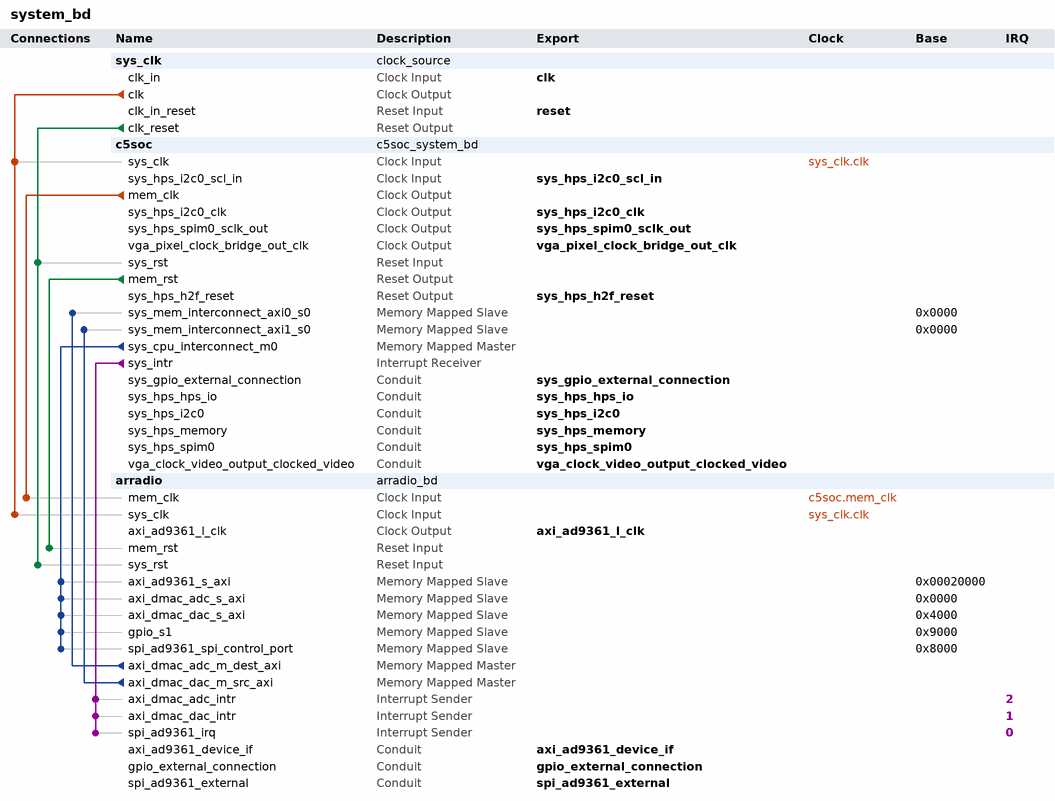
[diagram p0: system contents]
# Platform Designer (Qsys) system system_bd, Cyclone V 5CSXFC6D6F31C8ES
# Parameters at their usual value, and those the tool derives, are not listed.
package require -exact qsys 16.0
create_system system_bd
set_project_property DEVICE_FAMILY {Cyclone V}
set_project_property DEVICE 5CSXFC6D6F31C8ES

add_instance sys_clk clock_source 16.0
set_instance_parameter_value sys_clk clockFrequency 50000000

add_instance c5soc c5soc_system_bd 1.0

add_instance arradio arradio_bd 1.0

# connections
add_connection c5soc.mem_clk arradio.mem_clk clock
add_connection sys_clk.clk arradio.sys_clk clock
add_connection sys_clk.clk c5soc.sys_clk clock
add_connection c5soc.mem_rst arradio.mem_rst reset
add_connection sys_clk.clk_reset arradio.sys_rst reset
add_connection sys_clk.clk_reset c5soc.sys_rst reset
add_connection arradio.axi_dmac_adc_m_dest_axi c5soc.sys_mem_interconnect_axi0_s0 avalon
set_connection_parameter_value arradio.axi_dmac_adc_m_dest_axi/c5soc.sys_mem_interconnect_axi0_s0 baseAddress 0x0000
add_connection arradio.axi_dmac_dac_m_src_axi c5soc.sys_mem_interconnect_axi1_s0 avalon
set_connection_parameter_value arradio.axi_dmac_dac_m_src_axi/c5soc.sys_mem_interconnect_axi1_s0 baseAddress 0x0000
add_connection c5soc.sys_cpu_interconnect_m0 arradio.axi_ad9361_s_axi avalon
set_connection_parameter_value c5soc.sys_cpu_interconnect_m0/arradio.axi_ad9361_s_axi baseAddress 0x00020000
add_connection c5soc.sys_cpu_interconnect_m0 arradio.axi_dmac_adc_s_axi avalon
set_connection_parameter_value c5soc.sys_cpu_interconnect_m0/arradio.axi_dmac_adc_s_axi baseAddress 0x0000
add_connection c5soc.sys_cpu_interconnect_m0 arradio.axi_dmac_dac_s_axi avalon
set_connection_parameter_value c5soc.sys_cpu_interconnect_m0/arradio.axi_dmac_dac_s_axi baseAddress 0x4000
add_connection c5soc.sys_cpu_interconnect_m0 arradio.gpio_s1 avalon
set_connection_parameter_value c5soc.sys_cpu_interconnect_m0/arradio.gpio_s1 baseAddress 0x9000
add_connection c5soc.sys_cpu_interconnect_m0 arradio.spi_ad9361_spi_control_port avalon
set_connection_parameter_value c5soc.sys_cpu_interconnect_m0/arradio.spi_ad9361_spi_control_port baseAddress 0x8000
add_connection c5soc.sys_intr arradio.axi_dmac_adc_intr interrupt
set_connection_parameter_value c5soc.sys_intr/arradio.axi_dmac_adc_intr irqNumber 2
add_connection c5soc.sys_intr arradio.axi_dmac_dac_intr interrupt
set_connection_parameter_value c5soc.sys_intr/arradio.axi_dmac_dac_intr irqNumber 1
add_connection c5soc.sys_intr arradio.spi_ad9361_irq interrupt
set_connection_parameter_value c5soc.sys_intr/arradio.spi_ad9361_irq irqNumber 0

# exported interfaces
add_interface axi_ad9361_device_if conduit end
set_interface_property axi_ad9361_device_if EXPORT_OF arradio.axi_ad9361_device_if
add_interface axi_ad9361_l_clk clock source
set_interface_property axi_ad9361_l_clk EXPORT_OF arradio.axi_ad9361_l_clk
add_interface clk clock sink
set_interface_property clk EXPORT_OF sys_clk.clk_in
add_interface gpio_external_connection conduit end
set_interface_property gpio_external_connection EXPORT_OF arradio.gpio_external_connection
add_interface reset reset sink
set_interface_property reset EXPORT_OF sys_clk.clk_in_reset
add_interface spi_ad9361_external conduit end
set_interface_property spi_ad9361_external EXPORT_OF arradio.spi_ad9361_external
add_interface sys_gpio_external_connection conduit end
set_interface_property sys_gpio_external_connection EXPORT_OF c5soc.sys_gpio_external_connection
add_interface sys_hps_h2f_reset reset source
set_interface_property sys_hps_h2f_reset EXPORT_OF c5soc.sys_hps_h2f_reset
add_interface sys_hps_hps_io conduit end
set_interface_property sys_hps_hps_io EXPORT_OF c5soc.sys_hps_hps_io
add_interface sys_hps_i2c0 conduit end
set_interface_property sys_hps_i2c0 EXPORT_OF c5soc.sys_hps_i2c0
add_interface sys_hps_i2c0_clk clock source
set_interface_property sys_hps_i2c0_clk EXPORT_OF c5soc.sys_hps_i2c0_clk
add_interface sys_hps_i2c0_scl_in clock sink
set_interface_property sys_hps_i2c0_scl_in EXPORT_OF c5soc.sys_hps_i2c0_scl_in
add_interface sys_hps_memory conduit end
set_interface_property sys_hps_memory EXPORT_OF c5soc.sys_hps_memory
add_interface sys_hps_spim0 conduit end
set_interface_property sys_hps_spim0 EXPORT_OF c5soc.sys_hps_spim0
add_interface sys_hps_spim0_sclk_out clock source
set_interface_property sys_hps_spim0_sclk_out EXPORT_OF c5soc.sys_hps_spim0_sclk_out
add_interface vga_clock_video_output_clocked_video conduit end
set_interface_property vga_clock_video_output_clocked_video EXPORT_OF c5soc.vga_clock_video_output_clocked_video
add_interface vga_pixel_clock_bridge_out_clk clock source
set_interface_property vga_pixel_clock_bridge_out_clk EXPORT_OF c5soc.vga_pixel_clock_bridge_out_clk

set_interconnect_requirement {$system} qsys_mm.clockCrossingAdapter FIFO
set_interconnect_requirement {$system} qsys_mm.maxAdditionalLatency 2
set_interconnect_requirement {mm_interconnect_0|cmd_mux} qsys_mm.postTransform.pipelineCount 0
set_interconnect_requirement {mm_interconnect_2|cmd_mux} qsys_mm.postTransform.pipelineCount 0
set_interconnect_requirement {mm_interconnect_3|cmd_mux} qsys_mm.postTransform.pipelineCount 0
set_interconnect_requirement {mm_interconnect_3|cmd_mux_001} qsys_mm.postTransform.pipelineCount 0
set_interconnect_requirement {mm_interconnect_4|axi_dmac_dac_m_src_axi_agent.write_cp/router.sink} qsys_mm.postTransform.pipelineCount 0
set_interconnect_requirement {mm_interconnect_4|cmd_mux} qsys_mm.postTransform.pipelineCount 0
set_interconnect_requirement {mm_interconnect_4|cmd_mux_001} qsys_mm.postTransform.pipelineCount 0

save_system system_bd.qsys
